# Altium schematic sheet Polos y ceros.SchDoc
size Letter
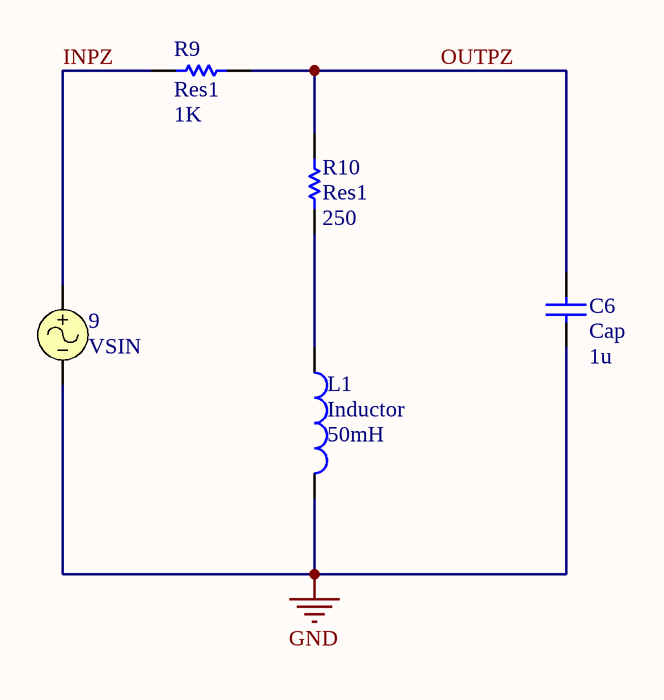
[diagram p0: Polos y ceros.SchDoc]

## Parts
9  VSIN
C6  Cap  value 1u  [RAD-0.3]
L1  Inductor  value 50mH  [0402-A]
R9  Res1  value 1K  [AXIAL-0.3]
R10  Res1  value 250  [AXIAL-0.3]

## Nets
GND: 9.2 C6.1 L1.2
INPZ: 9.1 R9.1
OUTPZ: C6.2 R9.2 R10.2
NetL1_1: L1.1 R10.1

## Notes on the sheet
- Project:
- Page content:
- Size:
- Revisión
- Letter
- Document Number
- Design:
- Date:
- Sheet:
- of

## Library data of the parts
9 = VSIN: Sinusoidal Voltage Source; Note: PCB Footprint - Not required; Published: 8-Jun-2000; LatestRevisionDate: 15-Nov-2004; LatestRevisionNote: Corrected Netlist.; PackageReference: Not Applicable; Publisher: Altium Limited
C6 = Cap: Capacitor; Published: 8-Jun-2000; LatestRevisionDate: 17-Jul-2002; LatestRevisionNote: Re-released for DXP Platform.; PackageReference: RAD-0.3; Publisher: Altium Limited; PackageDescription: Radial Cap, Thru-Hole; 2 Leads; 0.3 in Pin Spacing
L1 = Inductor: Code_IEC: 1005; Published: 8-Jun-2000; LatestRevisionDate: 29-May-2009; LatestRevisionNote: IPC-7351 Footprint Added.; PackageReference: 0402-A; Publisher: Altium Limited; PackageDescription: Chip Inductor; Code_JEITA: 0402
R9 R10 = Res1: Resistor; Published: 8-Jun-2000; LatestRevisionDate: 17-Jul-2002; LatestRevisionNote: Re-released for DXP Platform.; PackageReference: AXIAL-0.3; Publisher: Altium Limited; PackageDescription: Axial Device, Thru-Hole; 2 Leads; 0.3 in Pin Spacing